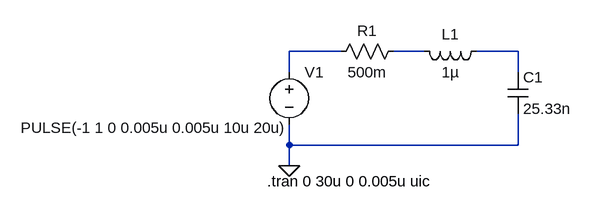
[diagram p0: schematic tran_network6.asc]
tran_network6.asc, the LTspice schematic file:
Version 4
SHEET 1 880 680
WIRE 96 96 16 96
WIRE 224 96 176 96
WIRE 368 96 304 96
WIRE 16 128 16 96
WIRE 368 128 368 96
WIRE 16 240 16 208
WIRE 368 240 368 192
WIRE 368 240 16 240
WIRE 16 272 16 240
FLAG 16 272 0
SYMBOL voltage 16 112 R0
WINDOW 3 -413 101 Left 2
WINDOW 123 0 0 Left 2
WINDOW 39 0 0 Left 2
SYMATTR InstName V1
SYMATTR Value PULSE(-1 1 0 0.005u 0.005u 10u 20u)
SYMBOL res 192 80 R90
WINDOW 0 0 56 VBottom 2
WINDOW 3 32 56 VTop 2
SYMATTR InstName R1
SYMATTR Value 500m
SYMBOL ind 320 80 R90
WINDOW 0 5 56 VBottom 2
WINDOW 3 32 56 VTop 2
SYMATTR InstName L1
SYMATTR Value 1µ
SYMBOL cap 352 128 R0
SYMATTR InstName C1
SYMATTR Value 25.33n
TEXT -18 296 Left 2 !.tran 0 30u 0 0.005u uic

The netlist it stands for:
* tran_network6.asc
V1 N001 0 PULSE(-1 1 0 0.005u 0.005u 10u 20u)
R1 N002 N001 500m
L1 N003 N002 1µ
C1 N003 0 25.33n
.tran 0 30u 0 0.005u uic
.backanno
.end